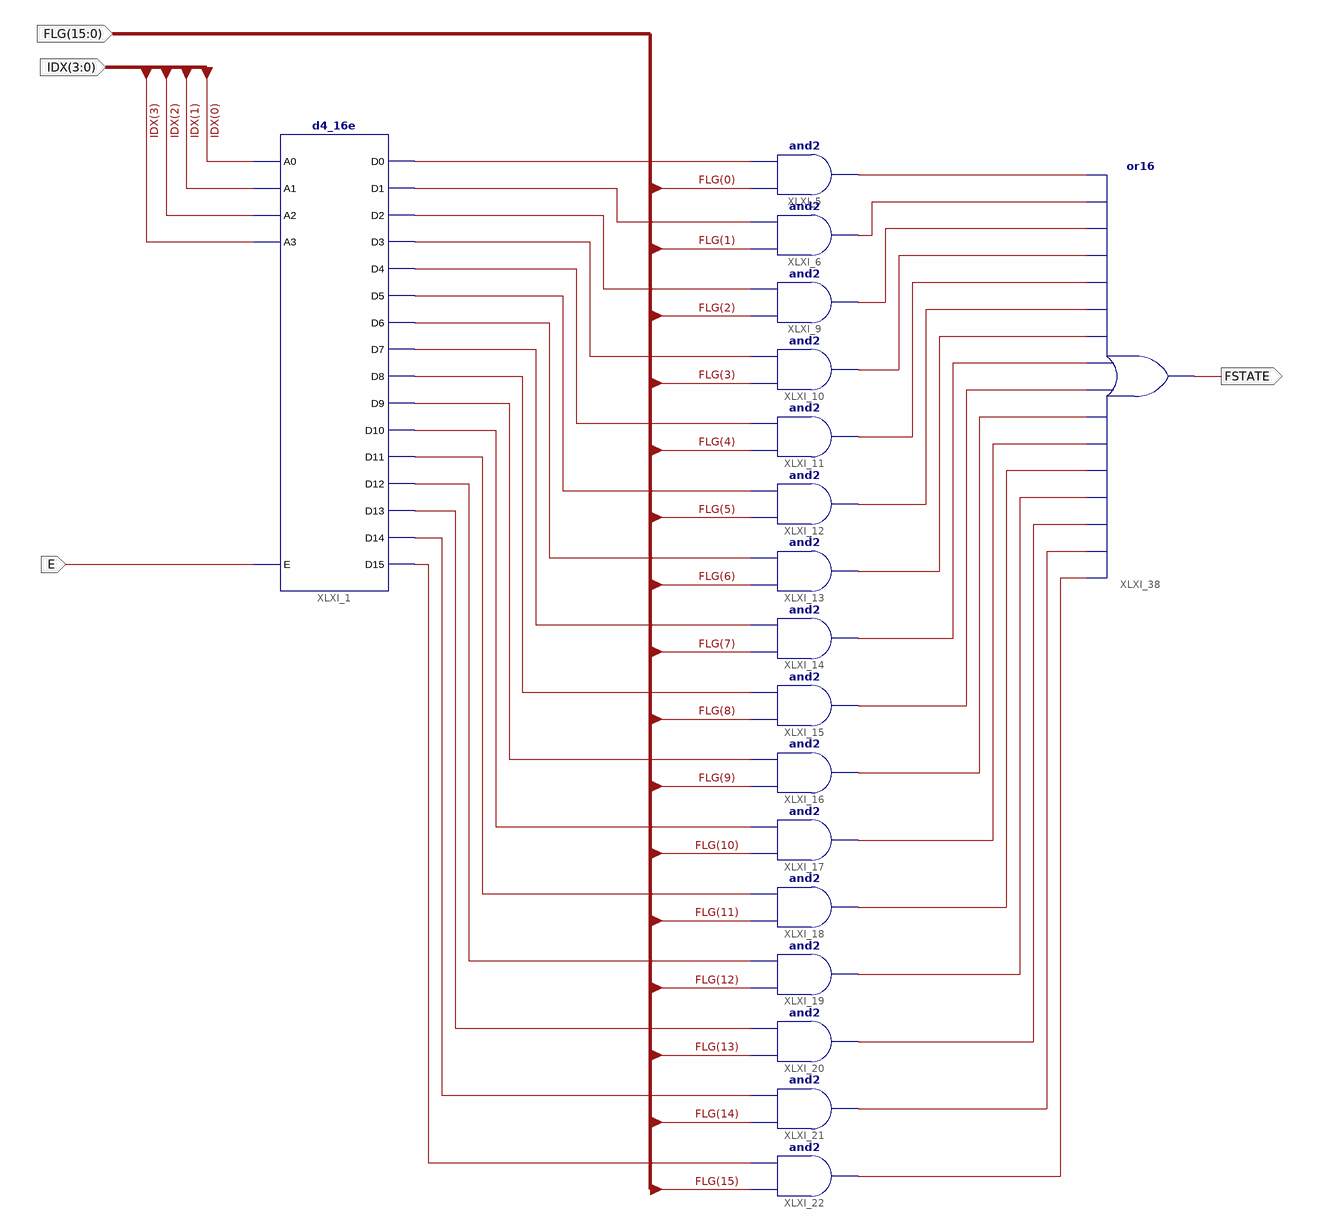
[diagram p0: schematic sheet 1]
// Xilinx ISE schematic flgchk.sch (spartan6) as structural Verilog: 18 symbols, 4 ports
module flgchk (
  input  [3:0] IDX,
  input  [15:0] FLG,
  input  E,
  output FSTATE
);

  wire XLXN_26, XLXN_27, XLXN_28, XLXN_30, XLXN_31, XLXN_32, XLXN_33, XLXN_34, XLXN_35, XLXN_36, XLXN_37,
       XLXN_38, XLXN_39, XLXN_40, XLXN_41, XLXN_42, XLXN_64, XLXN_65, XLXN_66, XLXN_67, XLXN_68, XLXN_69,
       XLXN_70, XLXN_71, XLXN_72, XLXN_73, XLXN_75, XLXN_77, XLXN_78, XLXN_79, XLXN_80, XLXN_81;

  d4_16e XLXI_1 (
    .A0(IDX[0]), .A1(IDX[1]), .A2(IDX[2]), .A3(IDX[3]), .E(E), .D0(XLXN_26), .D1(XLXN_27), .D10(XLXN_37),
    .D11(XLXN_38), .D12(XLXN_39), .D13(XLXN_40), .D14(XLXN_41), .D15(XLXN_42), .D2(XLXN_28), .D3(XLXN_30),
    .D4(XLXN_31), .D5(XLXN_32), .D6(XLXN_33), .D7(XLXN_34), .D8(XLXN_35), .D9(XLXN_36));
  and XLXI_5 (XLXN_64, FLG[0], XLXN_26);
  and XLXI_6 (XLXN_65, FLG[1], XLXN_27);
  and XLXI_9 (XLXN_66, FLG[2], XLXN_28);
  and XLXI_10 (XLXN_67, FLG[3], XLXN_30);
  and XLXI_11 (XLXN_68, FLG[4], XLXN_31);
  and XLXI_12 (XLXN_69, FLG[5], XLXN_32);
  and XLXI_13 (XLXN_70, FLG[6], XLXN_33);
  and XLXI_14 (XLXN_71, FLG[7], XLXN_34);
  and XLXI_15 (XLXN_72, FLG[8], XLXN_35);
  and XLXI_16 (XLXN_73, FLG[9], XLXN_36);
  and XLXI_17 (XLXN_75, FLG[10], XLXN_37);
  and XLXI_18 (XLXN_77, FLG[11], XLXN_38);
  and XLXI_19 (XLXN_78, FLG[12], XLXN_39);
  and XLXI_20 (XLXN_79, FLG[13], XLXN_40);
  and XLXI_21 (XLXN_80, FLG[14], XLXN_41);
  and XLXI_22 (XLXN_81, FLG[15], XLXN_42);
  or XLXI_38 (FSTATE, XLXN_81, XLXN_80, XLXN_79, XLXN_78, XLXN_77, XLXN_75, XLXN_73, XLXN_72, XLXN_71, XLXN_70, XLXN_69, XLXN_68, XLXN_67, XLXN_66, XLXN_65, XLXN_64);
endmodule
